# EAGLE design T245-Atmega (EAGLE 9.6.2)
CNAME: TaaraLabs.eu; CREVISION: 1.0; DESIGNER: Märt Maiste
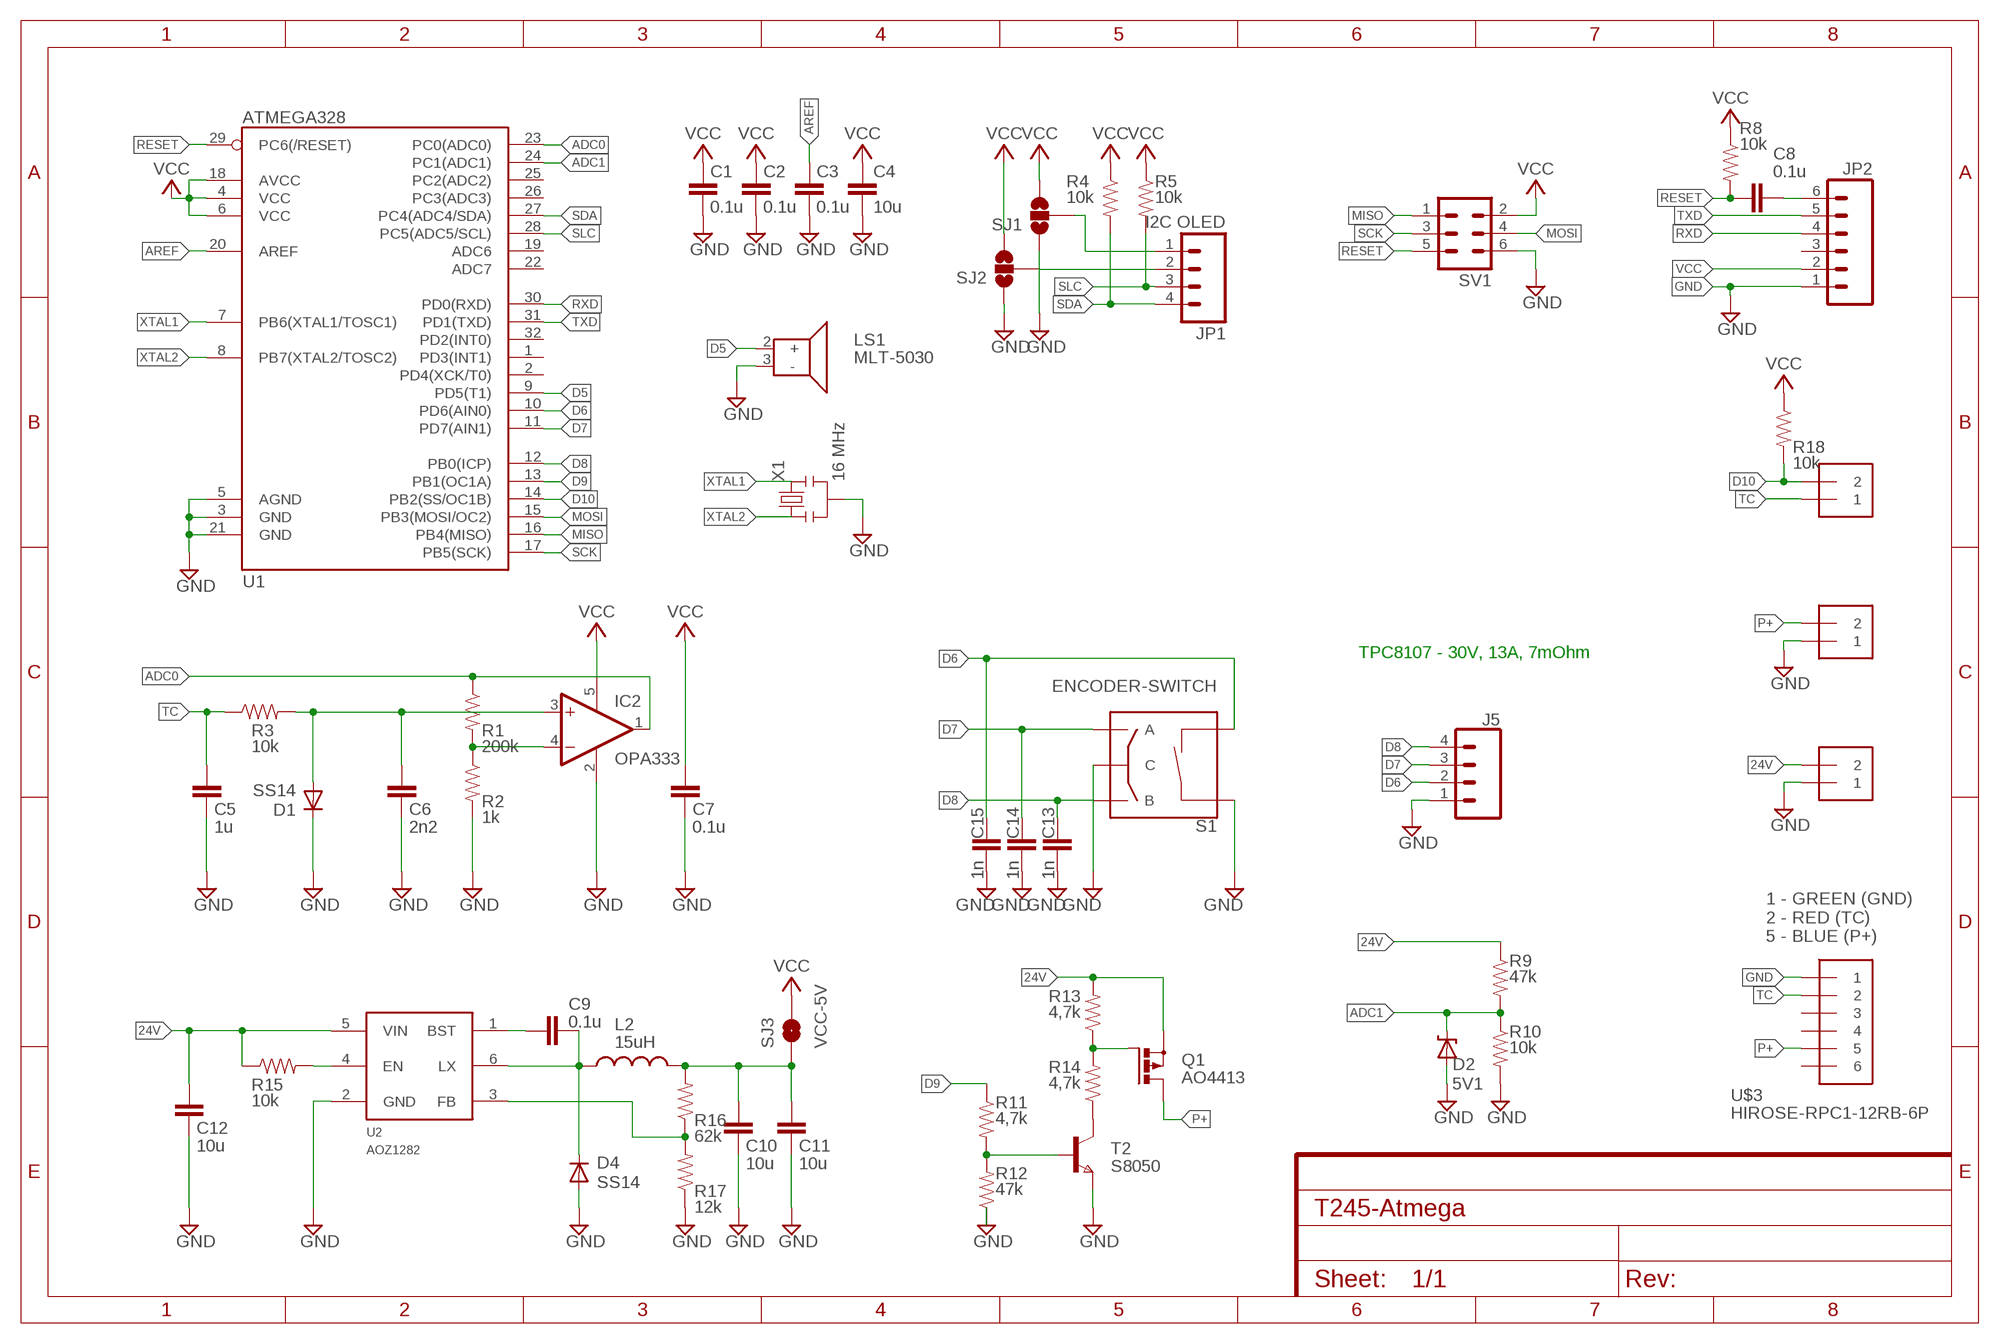
[diagram p0: schematic, sheet 1]

## Parts
C1  0.1u  CAP0805  [0805]
C2  0.1u  CAP0805  [0805]
C3  0.1u  CAP0805  [0805]
C4  10u  CAP0805  [0805]
C5  1u  CAP0805  [0805]
C6  2n2  CAP0805  [0805]
C7  0.1u  CAP0805  [0805]
C8  0.1u  CAP0805  [0805]
C9  0.1u  CAP0805  [0805]
C10  10u  CAP0805  [0805]
C11  10u  CAP0805  [0805]
C12  10u  CAP1210  [1210]
C13  1n  CAP0805  [0805]
C14  1n  CAP0805  [0805]
C15  1n  CAP0805  [0805]
D1  SS14  DIODESOD-323F  [SOD-323F]
D2  5V1  DIODE-ZENER-BZT52  [SOD-323]
D4  SS14  DIODESOD-323F  [SOD-323F]
IC2  OPA333  OPA333DBV  [SOT23-5]
J1  HEATER  1X2-3.5MM  [1X2-3.5MM]
J3  Sensors  1X2-3.5MM  [1X2-3.5MM]
J4  24V  1X2-3.5MM  [1X2-3.5MM]
J5  M04SMALL_DIAMETER  [1X04_SMALL_DIAMETER]
JP1  I2C OLED  M04SMALL_DIAMETER  [1X04_SMALL_DIAMETER]
JP2  M06SIP  [1X06]
L2  15uH  INDUCTOR1210  [1210]
LS1  MLT-5030  BUZZER-0540-T-7-R  [SMT0540T7R]
Q1  AO4413  P-MOSFET-SO8  [SO-08]
R1  200k  RESISTOR0805-RES  [0805]
R2  1k  RESISTOR0805-RES  [0805]
R3  10k  RESISTOR0805-RES  [0805]
R4  10k  RESISTOR0805-RES  [0805]
R5  10k  RESISTOR0805-RES  [0805]
R8  10k  RESISTOR0805-RES  [0805]
R9  47k  RESISTOR0805-RES  [0805]
R10  10k  RESISTOR0805-RES  [0805]
R11  4,7k  RESISTOR0805-RES  [0805]
R12  47k  RESISTOR0805-RES  [0805]
R13  4,7k  RESISTOR0805-RES  [0805]
R14  4,7k  RESISTOR0805-RES  [0805]
R15  10k  RESISTOR0805-RES  [0805]
R16  62k  RESISTOR0805-RES  [0805]
R17  12k  RESISTOR0805-RES  [0805]
R18  10k  RESISTOR0805-RES  [0805]
S1  ENCODER-SWITCH  [ROTARY_ENC_PLAIN]
SJ1  SOLDERJUMPER_2WAYPASTE1&2  [SJ_3_PASTE1&2]
SJ2  SOLDERJUMPER_2WAYPASTE2&3  [SJ_3_PASTE2&3]
SJ3  VCC-5V  SOLDERJUMPERNC2  [SJ_2S-NOTRACE]
SV1  MA03-2  [MA03-2]
T2  S8050  NPNSOT23SOT-23-DOCU  [SOT-23-DOCU]
U1  ATMEGA328  ATMEGA168  [TQFP32-08]
U2  AOZ1282  AOZ1282CI  [SOT23-6]
U$3  HIROSE-RPC1-12RB-6P  [HIROSER-PC1-12RB-6P]
X1  16 MHz  RESONATORSMD  [RESONATOR-SMD]

## Nets
5V: C10.1 C11.1 L2.2 R16.2 SJ3.1
24V [power]: C12.1 J4.2 Q1.1(S) Q1.2(S) Q1.3(S) R9.1 R13.2 R15.1 U2.5(VIN)
ADC0: IC2.1(OUT) R1.1 U1.23(PC0(ADC0))
ADC1: D2.1(C) R9.2 R10.1 U1.24(PC1(ADC1))
AREF: C3.1 U1.20(AREF)
BASE: R11.2 R12.2 T2.3(B)
BST: C9.1 U2.1(BST)
COLLECTOR: R14.1 T2.1(C)
D5: LS1.2(+) U1.9(PD5(T1))
D6: C15.2 J5.2 S1.SW- U1.10(PD6(AIN0))
D7: C14.2 J5.3 S1.A U1.11(PD7(AIN1))
D8: C13.2 J5.4 S1.B U1.12(PB0(ICP))
D9: R11.1 U1.13(PB1(OC1A))
D10: J3.2 R18.2 U1.14(PB2(SS/OC1B))
DTR: C8.2 JP2.6
EN: R15.2 U2.4(EN)
FB: R16.1 R17.2 U2.3(FB)
GATE: Q1.4(G) R13.1 R14.2
GND [power]: C1.2 C2.2 C3.2 C4.2 C5.2 C6.2 C7.2 C10.2 C11.2 C12.2 C13.1 C14.1 C15.1 D1.C D2.2(A) D4.A IC2.2(V-) J1.1 J4.1 J5.1 JP2.1 LS1.3(-) R2.2 R10.2 R12.1 R17.1 S1.C S1.SW+ SJ1.1 SJ2.1 SV1.6 T2.2(E) U1.3(GND) U1.5(AGND) U1.21(GND) U2.2(GND) U$3.P$1 X1.2
IN+: C6.1 D1.A IC2.3(+IN) R3.2
IN-: IC2.4(-IN) R1.2 R2.1
LX: C9.2 D4.C L2.1 U2.6(LX)
MISO: SV1.1 U1.16(PB4(MISO))
MOSI: SV1.4 U1.15(PB3(MOSI/OC2))
N$2: JP1.2 SJ2.2
N$4: JP1.1 SJ1.2
P+ [power]: J1.2 Q1.5(D) Q1.6(D) Q1.7(D) Q1.8(D) U$3.P$5
RESET: C8.1 R8.2 SV1.5 U1.29(PC6(/RESET))
RXD: JP2.4 U1.30(PD0(RXD))
SCK: SV1.3 U1.17(PB5(SCK))
SDA: JP1.4 R4.2 U1.27(PC4(ADC4/SDA))
SLC: JP1.3 R5.2 U1.28(PC5(ADC5/SCL))
TC: C5.1 J3.1 R3.1 U$3.P$2
TXD: JP2.5 U1.31(PD1(TXD))
VCC: C1.1 C2.1 C4.1 C7.1 IC2.5(V+) JP2.2 R4.1 R5.1 R8.1 R18.1 SJ1.3 SJ2.3 SJ3.2 SV1.2 U1.4(VCC) U1.6(VCC) U1.18(AVCC)
XTAL1: U1.7(PB6(XTAL1/TOSC1)) X1.3
XTAL2: U1.8(PB7(XTAL2/TOSC2)) X1.1
Unconnected: JP2.3 U1.1(PD3(INT1)) U1.2(PD4(XCK/T0)) U1.19(ADC6) U1.22(ADC7) U1.25(PC2(ADC2)) U1.26(PC3(ADC3)) U1.32(PD2(INT0)) U$3.P$3 U$3.P$4 U$3.P$6

## Notes on the sheet
- TPC8107 - 30V, 13A, 7mOhm
- 1 - GREEN (GND)
  2 - RED (TC)
  5 - BLUE (P+)

## Library data of the parts
C1-C11 C13-C15 = SparkFun:CAP: Capacitor Standard 0603 ceramic capacitor, and 0.1" leaded capacitor.
C12 = TaaraLabs:CAP: Capacitor Standard 0603 ceramic capacitor, and 0.1" leaded capacitor.
D1 D4 = adafruit:DIODE: Diode SMADIODE - SMA Surface Mount Package 20V 1A Schottky Diode Digikey: 641-1014-6-ND DO-1N4148 - Through Hole Small Current Diode SOD-123 20V 1 A (.5mV Vf) Schottky Diode - Digikey: MBRX120TPMSCT-ND SOD-323 10V 570mA (.38mV Vf, 3ns) Schottky Diode - Digikey: ZLLS410CT-ND SOD-523 30V 30mA Schottky Diode (RB751S-40TE61) - Digikey: RB751S-40TE61CT-ND SOT23-R/W - SOT23 Package (R = Solder Paste/Reflow Ovens, W = Hand-Soldering) BAT54Film 40V 300mA - Digikey: 497-7162-1-ND
D2 = SparkFun:DIODE-ZENER: Zener Diode Production Part - 8199 3.4V Zener Voltage
IC2 = TaaraLabs:OPA333: 1.8V, microPOWER CMOS OPERATIONAL AMPLIFIERS Zerø-Drift Series Source: Texas Instruments (Burr-Brown) .. U11 opa333 Operational Amp.pdf
J1 J3 J4 = adafruit:1X2: 3.5mm Terminal block http://www.ladyada.net/library/pcb/eaglelibrary.html
J5 JP1 = TaaraLabs:M04: Header 4 Standard 4-pin 0.1" header. Use with straight break away headers (SKU : PRT-00116), right angle break away headers (PRT-00553), swiss pins (PRT-00743), machine pins (PRT-00117), and female headers (PRT-00115). Molex polarized connector foot print use with SKU : PRT-08231 with associated crimp pins and housings. 1MM SMD Version SKU: PRT-10208
JP2 = TaaraLabs:M06: Header 6 Standard 6-pin 0.1" header. Use with straight break away headers (SKU : PRT-00116), right angle break away headers (PRT-00553), swiss pins (PRT-00743), machine pins (PRT-00117), and female headers (PRT-00115). Molex polarized connector foot print use with SKU : PRT-08094 with associated crimp pins and housings. NOTES ON THE VARIANTS LOCK and LOCK_LONGPADS... This footprint was designed to help hold the alignment of a through-hole component (i.e. 6-pin header) while soldering it into place. You may notice that each hole has been shifted either up or down by 0.005 of an inch from it's more standard position (which is a perfectly straight line). This slight alteration caused the pins (the squares in the middle) to touch the edges of the holes. Because they are alternating, it causes a "brace" to hold the component in place. 0.005 has proven to be the perfect amount of "off-center" position when using our standard breakaway headers. Although looks a little odd when you look at the bare footprint, once you have a header in there, the alteration is very hard to notice. Also, if you push a header all the way into place, it is covered up entirely on the bottom side. This idea of altering the position of holes to aid alignment will be further integrated into the Sparkfun Library for other footprints. It can help hold any component with 3 or more connection pins.
L2 = TaaraLabs:INDUCTOR: Inductors Basic Inductor/Choke - 0603 and 1206. Footprints are not proven and vary greatly between part numbers.
LS1 = Buzzer-0540-T-7-R:BUZZER-0540-T-7-R: Speakers & Transducers 3VP-P 100MA GOLD PLATED LEADS Source: Datasheet <https://www.mouser.com/datasheet/2/334/SMT-0540-T-7-R-71405.pdf>; DESCRIPTION: Speakers & Transducers 3VP-P 100MA GOLD PLATED LEADS; HEIGHT: 2.1mm; MANUFACTURER_NAME: PUI Audio; MANUFACTURER_PART_NUMBER: SMT-0540-T-7-R; MOUSER_PART_NUMBER: 665-SMT0540T7R; MOUSER_PRICE-STOCK: https://www.mouser.co.uk/ProductDetail/PUI-Audio/SMT-0540-T-7-R/?qs=F7UM01vn%252BgOPXs4CtFA51w%3D%3D
Q1 = TaaraLabs:P-MOSFET-SO8: P-Channel MOSFET Example: FDS4435A; P-Channel Logic Level PowerTrench® MOSFET FDS4465; P-Channel 1.8V Specified PowerTrench® MOSFET Source: www.fairchildsemi.com
R1-R5 R8-R18 = SparkFun:RESISTOR: Resistor Basic schematic elements and footprints for 0603, 1206, and PTH resistors.
S1 = TaaraLabs:ENCODER-SWITCH: Rotary Encoder w/ Select Switch Encoders rotate similarly to potentiometers, but they’re different from potentiometers in that an encoder has full rotation without limits. They output gray code so that you can tell how much and in which direction the encoder has been turned. This encoder includes a push-down select switch built into the shaft. SparkFun Products Rotary Encoder <https://www.sparkfun.com/products/9117> (COM-09117); SF_SKU: COM-09117
SJ1 SJ2 = SparkFun:SOLDERJUMPER_2WAY: Solder Jumper 2 way solder jumper
SJ3 = SparkFun:SOLDERJUMPER: Solder Jumper Standard SMD solder jumper. Used to automate production. Two varients : Normally Open and Normally Closed are the same, but have different paste layers. NC will have a large amount of paste and should jumper during reflow.
SV1 = JeeLabs:MA03-2: PIN HEADER
T2 = TaaraLabs:NPNSOT23: NPN TRANSISTOR
U1 = SparkFun:ATMEGA168
U2 = TaaraLabs:AOZ1282CI
U$3 = Hirose-RPC1-12RB-6P:HIROSE-RPC1-12RB-6P
X1 = SparkFun:RESONATOR: Resonator Small SMD resonator. This is the itty bitty 10/20MHz resonators with built in caps. CSTCE10M0G55 and CSTCE20M0V53. Footprint has been reviewed closely but hasn't been tested yet.

## Net classes
0 default: width 0.203 mm, clearance 0.203 mm
1 power: width 0.381 mm, clearance 0.254 mm

## Board
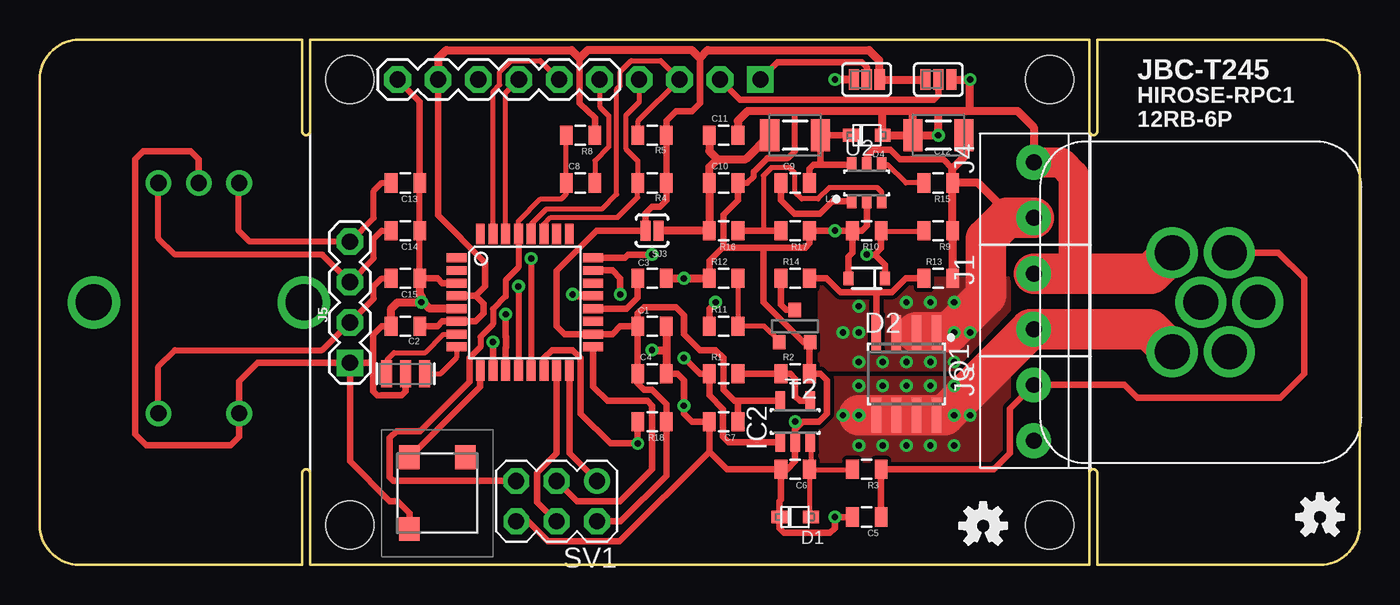
[diagram p1: board, top side]
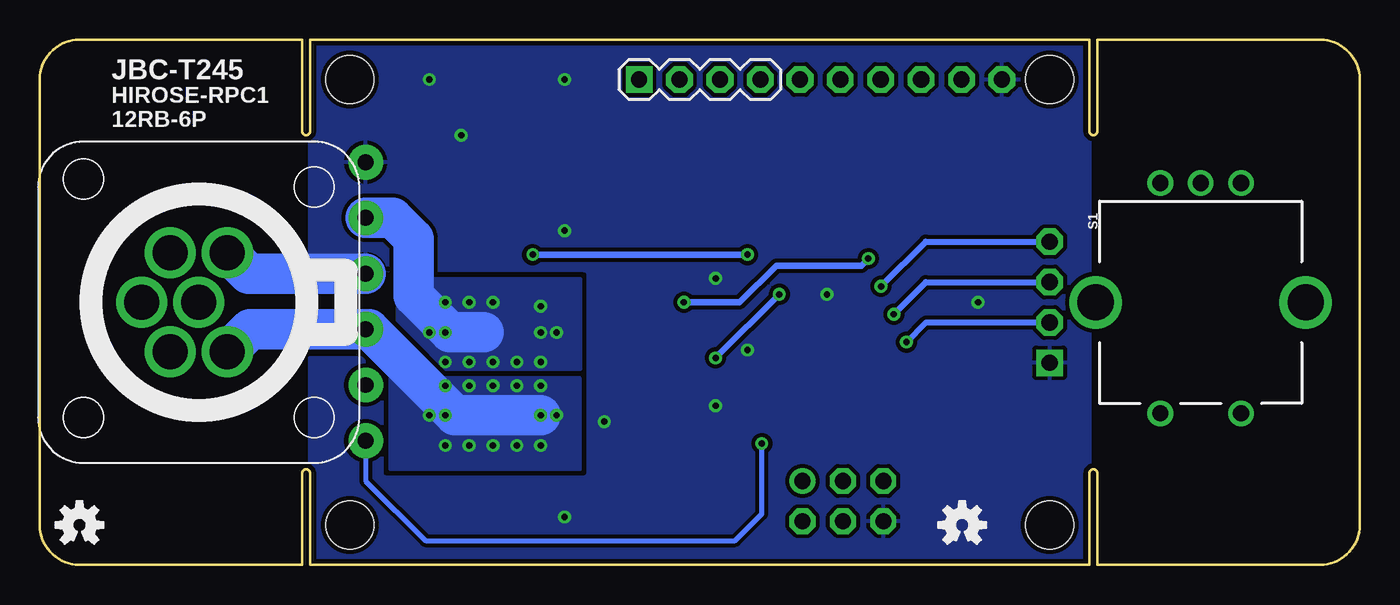
[diagram p2: board, bottom side, seen from below]

Size 83 x 33 mm. Coordinates in mm from the lower left corner, seen from the top.
Outline: 83,30.5 83,2.5 arc-90 80.5,0 66.5,0 66.5,5.75 arc90 66.25,6 arc90 66,5.75 66,0 17,0 17,5.75 arc90 16.75,6 arc90 16.5,5.75 16.5,0 2.5,0 arc-90 0,2.5 0,30.5 arc-90 2.5,33 16.5,33 16.5,27.25 arc90 16.75,27 arc90 17,27.25 17,33 66,33 66,27.25 arc90 66.25,27 arc90 66.5,27.25 66.5,33 80.5,33 arc-90 83,30.5
Copper layers (1*16): Top 0.035mm / dielectric 1.5mm / Bottom 0.035mm
Design rules "default *": minimum track width 12mil, minimum drill 0.4mm, track to track 8mil, track to pad 8mil, pad to pad 8mil, via to via 8mil, smd to smd 8mil, copper to edge 12mil, drill to drill 0.4mm, minimum pad ring 0.3mm, minimum via ring 8mil, stop-mask expansion 4mil, vias tented up to drill 20mil, thermal gap 10mil
Holes 3 mm at 19.5,30.5 19.5,2.5 63.5,30.5 63.5,2.5

### Footprints (pad centres in the part's own frame; a part is rotated, then mirrored left to right if it is on the bottom)
0805 = smd 0.8 x 1.2: 1 -0.9,0; 2 0.9,0
1210 = smd 1.2 x 2: 1 -1.6,0; 2 1.6,0
SOD-323F = smd 1 x 0.8: A -1,0; C 1,0
SOD-323 = smd 0.63 x 0.83: 1 -1.15,0; 2 1.15,0
SOT23-5 = smd 0.6 x 1.2: 1 -0.95,-1.306; 2 0,-1.306; 3 0.95,-1.306; 4 0.95,1.306; 5 -0.95,1.306
1X2-3.5MM = drill 1 pad 2.184: 1 1.8,0; 2 -1.7,0
1X04_SMALL_DIAMETER = drill 1.016 pad 1.676 square: 1 -3.81,0 | drill 1.016 pad 1.676 octagon: 2 -1.27,0; 3 1.27,0; 4 3.81,0
1X06 = drill 1.016 pad 1.676 octagon: 1 0,0; 2 2.54,0; 3 5.08,0; 4 7.62,0; 5 10.16,0; 6 12.7,0
SMT0540T7R = smd 1.5 x 1.3: 1 -2.25,1.75; 2 -2.25,-1.75; 3 2.25,-1.75
SO-08 = smd 0.6 x 2.2: 1 -1.905,-2.6; 2 -0.635,-2.6; 3 0.635,-2.6; 4 1.905,-2.6; 5 1.905,2.6; 6 0.635,2.6; 7 -0.635,2.6; 8 -1.905,2.6
ROTARY_ENC_PLAIN = drill 1.016: A 7.493,-2.54; B 7.493,2.54; C 7.493,0; SW+ -6.985,2.54; SW- -6.985,-2.54 | drill 2.286: P$3 0,6.604; P$4 0,-6.604
SJ_3_PASTE1&2 = smd 0.635 x 1.27: 1 -0.813,0; 2 0,0; 3 0.813,0
SJ_3_PASTE2&3 = smd 0.635 x 1.27: 1 -0.813,0; 2 0,0; 3 0.813,0
SJ_2S-NOTRACE = smd 0.635 x 1.27: 1 -0.401,0; 2 0.413,0
MA03-2 = drill 1.016: 1 -2.54,-1.27 | drill 1.016 octagon: 2 -2.54,1.27; 3 0,-1.27; 4 0,1.27; 5 2.54,-1.27; 6 2.54,1.27
SOT-23-DOCU = smd 0.787 x 0.889: 1 0.025,-1.016; 2 -0.94,1.016; 3 0.991,1.016
TQFP32-08 = smd 1.27 x 0.559: 1 -4.293,2.8; 2 -4.293,2; 3 -4.293,1.2; 4 -4.293,0.4; 5 -4.293,-0.4; 6 -4.293,-1.2; 7 -4.293,-2; 8 -4.293,-2.8; 17 4.293,-2.8; 18 4.293,-2; 19 4.293,-1.2; 20 4.293,-0.4; 21 4.293,0.4; 22 4.293,1.2; 23 4.293,2; 24 4.293,2.8 | smd 0.559 x 1.27: 9 -2.8,-4.293; 10 -2,-4.293; 11 -1.2,-4.293; 12 -0.4,-4.293; 13 0.4,-4.293; 14 1.2,-4.293; 15 2,-4.293; 16 2.8,-4.293; 25 2.8,4.293; 26 2,4.293; 27 1.2,4.293; 28 0.4,4.293; 29 -0.4,4.293; 30 -1.2,4.293; 31 -2,4.293; 32 -2.8,4.293
SOT23-6 = smd 0.6 x 0.9: 1 -0.95,-1.15; 2 0,-1.15; 3 0.95,-1.15; 4 0.95,1.15; 5 0,1.15; 6 -0.95,1.15
HIROSER-PC1-12RB-6P = drill 2.2 pad 3.2: P$1 -1.8,-3.12; P$2 1.8,-3.12; P$3 3.6,0; P$4 1.8,3.12; P$5 -1.8,3.12; P$6 0,0
RESONATOR-SMD = smd 0.7 x 1.7: 1 -1.2,0; 2 0,0; 3 1.2,0

### Placement (x,y rotation side)
C1  38.5,15 0 top
C2  23,15 180 top
C3  38.5,18 0 top
C4  38.5,12 0 top
C5  52,3 180 top
C6  47.5,6 180 top
C7  43,9 180 top
C8  34,24 0 top
C9  47.5,24 0 top
C10  43,24 0 top
C11  43,27 0 top
C12  56.5,27 180 top
C13  23,24 180 top
C14  23,21 180 top
C15  23,18 180 top
D1  47.5,3 180 top
D2  52,18 180 top
D4  52,27 180 top
IC2  47.5,9 0 top
J1  62.5,16.5 90 top
J3  62.5,9.5 90 top
J4  62.5,23.5 90 top
J5  19.5,16.5 90 top
JP1  41.5,30.5 0 bottom
JP2  22.5,30.5 0 top
L2  47.5,27 180 top
LS1  25,4.5 270 top
Q1  54.5,12 180 top
R1  43,12 0 top
R2  47.5,12 0 top
R3  52,6 180 top
R4  38.5,24 180 top
R5  38.5,27 180 top
R8  34,27 180 top
R9  56.5,21 180 top
R10  52,21 180 top
R11  43,15 0 top
R12  43,18 0 top
R13  56.5,18 0 top
R14  47.5,18 0 top
R15  56.5,24 180 top
R16  43,21 180 top
R17  47.5,21 180 top
R18  38.5,9 180 top
S1  10,16.5 90 bottom
SJ1  52,30.5 0 top
SJ2  56.5,30.5 180 top
SJ3  38.5,21 180 top
SV1  32.5,4 180 top
T2  47.5,15 180 top
U1  30.5,16.5 0 top
U2  52,24 0 top
U$1  [OSHW-LOGO-S]  59.33,2.44 0 top
U$2  [OSHW-LOGO-S]  25,2.5 0 bottom
U$3  73,16.5 180 bottom
U$4  [OSHW-LOGO-S]  80.5,2.5 0 bottom
U$5  [OSHW-LOGO-S]  80.5,3 0 top
X1  23,12 180 top

### Tracks (layer width: path | path; a pad name or v marks a point on that pad's centre or on a via)
5V
  Top 0.508: SJ3.1 R16.2 C10.1 42.1,25 42.6,25.5 | L2.2 44.4,25.5 42.6,25.5 | C11.1 42.1,26 42.6,25.5
24V  (via drill 0.4)
  Top 0.406: U2.5 52,25.67 52.42,26.08 53.5,26.08 54.09,25.49 56.81,25.49 57.4,24.9
  Top 0.508: R13.2 R9.1 R15.1 | R15.1 57.4,24.9 58.1,25.6 C12.1 | Q1.3 Q1.2 | J4.2 61.2,21.8 59,24 R15.1
  Top 2.54: J4.2 60.8,21.8 59.5,20.5 59.5,16.9 57.2,14.6 Q1.1 Q1.2
  Bottom 2.54: J4.2 60.8,21.8 59.5,20.5 59.5,16.9 57.2,14.6 55.1,14.6
  other vias: 51.5,12.75 53,12.75 54.5,12.75 56,12.75 57.5,12.75 54.5,16.5 56,16.5 57.5,16.5 51.5,14.6 51.5,16.25 57.5,14.6 50.5,14.6 58.5,14.6
  pour Top (no thermals): 49,12.25 57.5,12.25 61,16 61,18 49,18
  pour Bottom: 49,12.25 60.5,12.25 60.5,18 49,18
ADC0  (via drill 0.4)
  Top 0.406: IC2.1 43.31,7.69 42.96,8.04 42.96,9.79 42.1,10.65 R1.1 41.5,12 v40.5,13 | U1.23 36,18.5 36.5,18 v36.5,17
  Bottom 0.406: v40.5,13 v36.5,17
ADC1  (via drill 0.4)
  Top 0.305: R9.2 55.5,20.95 53.09,20.95 R10.1
  Top 0.406: R10.1 52.9,19.9 52.5,19.5 | 52.5,19.5 v52,19.5 | D2.1 53.15,18.85 52.5,19.5 | v38.5,19.5 37,19.5 36.8,19.3 U1.24
  Bottom 0.406: v52,19.5 v38.5,19.5
AREF
  Top 0.406: U1.20 36.9,16.1 37.6,16.8 C3.1
BASE
  Top 0.305: R12.2 43.94,17.91 43.94,15.11 R11.2 45.54,15 46.51,14.04 T2.3
BST
  Top 0.406: C9.1 46.6,22.9 47.44,22.06 49.06,22.06 49.85,22.85 U2.1
COLLECTOR
  Top 0.406: T2.1 46.92,16.02 46.6,16.33 R14.1
D5
  Top 0.406: U1.9 27.7,11.2 LS1.2
D6  (via drill 0.4)
  Top 0.381: C15.2 21.5,18 21,17.5 21,16.73 J5.2 17.77,13.5 8.5,13.5 7.46,12.46 S1.SW-
  Top 0.406: U1.10 v28.5,14
  Bottom 0.381: v28.5,14 27.27,15.23 J5.2
D7  (via drill 0.4)
  Top 0.381: C14.2 21.5,21 21,20.5 21,19.27 J5.3 17.77,19.5 8.5,19.5 7.46,20.54 S1.A
  Top 0.406: U1.11 29.3,13.65 29.31,13.66 29.31,14.34 29.3,14.35 v29.3,15.75
  Bottom 0.381: v29.3,15.75 27.28,17.77 J5.3
D8  (via drill 0.4)
  Top 0.305: 12.5,23.95 S1.B
  Top 0.381: C13.2 21.5,24 21,23.5 21,21.81 J5.4 13.19,20.31 12.5,21 12.5,23.95 | v30.1,17.5 U1.12
  Bottom 0.381: v30.1,17.5 27.29,20.31 J5.4
D9  (via drill 0.4)
  Top 0.381: v30.9,19.25 U1.13
  Top 0.406: R11.1 42.1,16.1 v42.5,16.5
  Bottom 0.406: v30.9,19.25 31.34,18.81 36.69,18.81 39,16.5 v42.5,16.5
D10  (via drill 0.4)
  Top 0.406: U1.14 31.7,13 32.2,13.5 33.5,13.5 34,13 34,9.5 35.88,7.62 v37.6,7.62 R18.2
  Bottom 0.305: v37.6,7.62 37.6,3.2 39.28,1.52 58.75,1.52 62.5,5.26 J3.2
DTR
  Top 0.305: JP2.6 35.2,28.8 35.77,28.23 35.77,26.27 34.9,25.4 C8.2
EN
  Top 0.305: R15.2 54.45,24 53.3,25.15 U2.4
FB
  Top 0.305: U2.3 52.95,23.43 52.67,23.71 49.65,23.71 48.95,23 47.9,23 47.5,23.4 47.5,24.6 47.14,24.96 46,24.96 45.5,24.46 45.5,21
  Top 0.406: R16.1 45.5,21 R17.2
GATE
  Top 0.406: R14.2 49.47,18 50.35,17.13 52.6,17.13 | 52.6,17.13 53.58,17.13 54.45,18 R13.1 | Q1.4 52.59,16.5 52.59,16.72 52.59,17.12 52.6,17.13
GND  (via drill 0.4)
  Top 0.381: 21.21,10.67 21.5,10.67 | 21.97,14.86 C2.2 | C15.1 C14.1 C13.1 | C10.2 44.5,24 44.9,24.4 44.9,24.71 45.75,25.55 47.06,25.55 47.5,26 47.5,28.5
  Top 0.406: 20.95,12.69 J5.1 | JP2.1 23.9,29.1 C13.1 | J5.1 19.5,6.5 22,4 22.5,4 23.25,3.25 LS1.3 | R12.1 42.1,19.1 42.94,19.94 43,19.94 | C10.2 43.9,22.9 43,22 43,19.94 | 45.5,19.94 48.14,19.94 48.4,20.2 R17.1 v50,21 R10.2 | 45.5,19.94 43,19.94 | D2.2 50.85,19.35 51.1,19.6 R10.2 | U2.2 52,21.3 51.7,21 R10.2 | 47.75,8.75 47.5,8.5 IC2.2 47.5,6.5 47,6 C6.2 | 47.75,8.75 48,9 49,9 49.5,9.5 49.5,11.6 49.1,12 R2.2 48.4,13.94 T2.2 48.02,13.98 45.5,16.5 45.5,19.94 | C6.2 46.6,4.1 46.5,4 D1.C 46.5,2.3 46.8,2 49.7,2 50,2.3 v50,3 C5.2 | SV1.6 30.71,2.73 31.98,1.47 36.47,1.47 42.1,7.1 | 42.1,7.1 C7.2 41,9 40.5,9.5 v40.5,10 40.5,11.6 40.1,12 C4.2 | C6.2 43.2,6 42.1,7.1 | U1.3 25.3,17.7 25,18 C15.1 | 20.95,12.69 20.95,14.46 21.5,15 21.83,15 21.97,14.86 | 20.95,12.69 20.95,10.92 21.21,10.67 | 21.5,10.67 22.75,10.67 23,10.92 X1.2 | J5.1 13.69,12.69 12.54,11.54 S1.SW+ 12.54,8.04 12,7.5 6.7,7.5 6,8.2 6,25.5 6.5,26 9.5,26 10,25.5 S1.C | v47.5,9 47.75,8.75
  Top 0.508: 58.5,28.51 61.49,28.51 62.5,27.5 J4.1 | 58.5,28.51 56.5,28.51 | 56.5,28.51 55,28.51 | 55,28.51 53,28.51 | 53,28.51 47.5,28.51 | 47.5,28.51 44.51,28.51 43.9,27.9 C11.2 | 53,28.51 D4.A C12.2 | 58.5,28.51 v58.5,30.5 SJ2.1 | SJ1.1 v50,30.5 | 47.5,28.5 47.5,28.51 | C15.1 23.9,17 24,16.9 v24,16.5 | C2.2 22.1,16.1 22.5,16.5 v24,16.5 | v24,16.5 24.12,16.5 24.52,16.1 U1.5 | C3.2 v40.5,18 R12.1 | U1.21 33.6,16.9 v33.5,17 | C1.2 39.4,13.5 | 39.4,13.5 C4.2 | v38.5,13.5 39.4,13.5 | C12.2 54.9,28.41 55,28.51 | C12.2 v56.5,27 56.5,28.51
  Top 1.9: J4.1 64.2,25.3 65,24.5 65,18.3
  Top 2.54: J1.1 65,18.3 69.88,18.3 U$3.P$1
  Bottom 2.54: J1.1 69.88,18.3 U$3.P$1
  pour Bottom: 61.5,13 61.5,5.75 arc-90 61.25,5.5 48.75,5.5 arc-90 48.5,5.75 48.5,18.25 arc-90 48.75,18.5 66,18.5 66,33 17,33 17,0 66,0 66,13
IN+
  Top 0.305: IC2.3 48.51,7.62 48.51,6.1 C6.1 | R3.2 51.05,5.97 48.64,5.97 C6.1 | C6.1 48.4,3.1 D1.A
IN-
  Top 0.406: R1.2 R2.1 47.2,12 47.5,11.7 47.5,10.6 47.79,10.31 IC2.4
LX
  Top 0.406: C9.2 48.4,24.9 48.65,25.15 49,25.15 | 49,25.15 U2.6 | 49,25.15 49.1,25.25 L2.1 D4.C
MISO
  Top 0.406: SV1.1 33.3,7.01 U1.16
MOSI
  Top 0.406: SV1.4 31.29,3.94 31.29,5.79 32.5,7 U1.15
N$2
  Top 0.406: JP1.2 44.04,29.23 56.23,29.23 56.5,29.5 SJ2.2
N$4
  Top 0.406: JP1.1 46.4,31.59 51.69,31.59 52,31.29 SJ1.2
P+  (via drill 0.4)
  Top 2.54: U$3.P$5 69.78,14.8 J1.2 62.3,14.8 56.9,9.4 Q1.8 Q1.7 Q1.6 Q1.5 v51.5,9.4
  Bottom 2.54: U$3.P$5 69.78,14.8 J1.2 62.3,14.8 56.9,9.4 v51.5,9.4
  other vias: 51.5,11.25 53,11.25 54.5,11.25 56,11.25 57.5,11.25 57.5,7.5 56,7.5 54.5,7.5 53,7.5 51.5,7.5 57.5,9.4 58.5,9.4 50.5,9.4
  pour Top (no thermals): 61,11.75 49,11.75 49,6.5 61,6.5
  pour Bottom: 49,11.75 61,11.75 61,6 49,6
RESET
  Top 0.305: U1.29 30.1,21.6 31.5,23 32.8,23 33.1,23.3 C8.1 R8.2
  Top 0.381: U1.29 30.1,18.7 29.3,17.9 29.3,16.88 28.5,16.08 28.5,15.13 27.7,14.33 27.7,13.7 27.69,13.69
  Top 0.406: 27.69,13.69 27.01,13.01 27.01,11.51 23.91,8.41 22.43,8.41 22,7.97 22,5.5 22.23,5.27 SV1.5
RXD
  Top 0.305: U1.30 29.3,29.68 JP2.4
SCK
  Top 0.305: 34.8,13.59 U1.17
  Top 0.406: SV1.3 33.77,4 36.5,4 38.5,6 38.5,10 38.2,10.3 35.7,10.3 34.8,11.2 34.8,13.59
SDA
  Top 0.305: JP1.4 37.69,29.08 36.84,28.23 36.84,26.16 37.6,25.4 R4.2 37.6,23.1 36.34,21.84 32.13,21.84 31.7,21.41 U1.27
SLC
  Top 0.305: R5.2 37.6,27.87 JP1.3 39.04,31.69 37.19,31.69 36.5,31 36.5,30.11 36.28,29.89 36.28,23.27 35.35,22.35 31.84,22.35 30.9,21.41 U1.28
TC
  Top 0.406: C5.1 R3.1 60,6 61,7 61,9.8 J3.1 68.2,11.3 69,10.5 78,10.5 79.5,12 79.5,18 77.88,19.62 U$3.P$2
TXD
  Top 0.305: JP2.5 31.47,31.69 29.63,31.69 28.93,31 28.93,30.16 28.5,29.73 U1.31
VCC
  Top 0.406: JP2.2 25.04,21.96 28,19 28,17.5 27.4,16.9 | 27.4,16.9 U1.4 | R8.1 34.9,28.1 33.95,29 33.95,31.85 | 41.5,31.85 41.5,29 41,28.5 40,28.5 39.4,27.9 R5.1 R4.1 39.4,22.9 39,22.5 38.5,22.5 38.09,22.09 SJ3.2 35,21 32.5,18.5 32.5,15 33,14.5 U1.18 36,14.5 36.5,15 C1.1 | C2.1 25,15 25.3,15.3 U1.6 27.4,15.3 27.9,15.8 27.9,16.4 27.4,16.9 | C1.1 C4.1 37.6,11.4 38,11 38.5,11 39.4,10.1 R18.1 39.4,5.6 36.53,2.73 SV1.2 | IC2.5 44,10.31 | 44,10.31 43.69,10.31 43,11 43,13 42.5,13.5 41.5,13.5 40.5,14.5 40.5,15.7 40,16.2 38,16.2 37.6,15.8 C1.1 | C7.1 43.9,10.21 44,10.31
  Top 0.508: SJ2.3 SJ1.3 52.77,30.54 52.77,31.73 52.15,32.35 42,32.35 41.5,31.85 40.98,32.37 34.47,32.37 33.95,31.85 33.45,32.35 25.55,32.35 25.04,31.84 JP2.2
XTAL1
  Top 0.305: U1.7 26.16,14.48 25.39,14.48 24.25,13.34 22.28,13.34 21.84,12.9 21.84,12.06 X1.3
XTAL2
  Top 0.305: U1.8 26.21,13.02 25.19,12 X1.1

### Text on the board
tPlace: JBC-T245 | HIROSE-RPC1 / 12RB-6P
bPlace: JBC-T245 | HIROSE-RPC1 / 12RB-6P
tValues: GND | 5V | RXD | TXD | DTR | SDA | SLC | + | - | T245-Atmega v1 | TaaraLabs.eu/sc1 | - | A | C | B | 24V | 1 | 2 | - | P+ | 5 | TC | D | E | RST | SCK | MISO | SH | 1-GND | 2-TC | GND | MOSI | VCC | 5-HEATER
bValues: GND | 5V | RXD | TXD | DTR | SDA | SLC | T245-Atmega v1 | TaaraLabs.eu/sc1 | - | A | C | B | 24V | B | 1 | 2 | A | - | E | HOT | P+ | 5 | C,D | TC | D | E | RST | SCK | MISO | HOT | SH | 1-GND | 2-TC | GND | MOSI | VCC | 5-HEATER
_bsilk: Serial OLED v1 | TaaraLabs.eu/so1